# Altium project Smartwatch.PrjPcb (part 2 of 2)

## Sheet IO_Expander.SchDoc: IO Expander
size A4; Engineer: Jason Skells; SheetNumber: 4; SheetTotal: 4
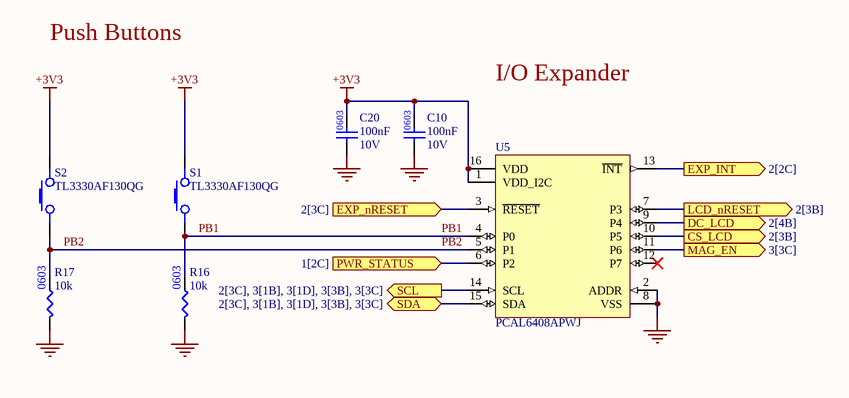
[diagram p3: IO_Expander.SchDoc]

### Parts
C10  Capacitance: 100nF  Voltage Rating: 10V  [CAP_0603]  (hidden comment: CC0603KRX7R6BB104)
C20  Capacitance: 100nF  Voltage Rating: 10V  [CAP_0603]  (hidden comment: CC0603KRX7R6BB104)
R16  Resistance: 10k  [RES_0603]  (hidden comment: RNCP0603FTD10K0)
R17  Resistance: 10k  [RES_0603]  (hidden comment: RNCP0603FTD10K0)
S1  TL3330AF130QG  [TL3330AF130QG]
S2  TL3330AF130QG  [TL3330AF130QG]
U5  PCAL6408APWJ  [PCAL6408APWJ]

### Ports
CS_LCD (out, see 2[3B]), DC_LCD (out, see 2[4B]), EXP_INT (out, see 2[2C]), EXP_nRESET (in, see 2[3C]), LCD_nRESET (out, see 2[3B]), MAG_EN (out, see 3[3C]), PWR_STATUS (in, see 1[2C]), SCL (out, see 2[3C], 3[1B], 3[1D], 3[3B], 3[3C]), SDA (bidir, see 2[3C], 3[1B], 3[1D], 3[3B], 3[3C])

### Nets
+3V3: C10.2 C20.2 S1.1 S2.1 U5.1(VDD_I2C) U5.16(VDD)
GND: C10.1 C20.1 R16.1 R17.1 U5.2(ADDR) U5.8(VSS)
CS_LCD: U5.10(P5) ; port CS_LCD
DC_LCD: U5.9(P4) ; port DC_LCD
EXP_INT: U5.13(~{INT}) ; port EXP_INT
EXP_nRESET: U5.3(~{RESET}) ; port EXP_nRESET
LCD_nRESET: U5.7(P3) ; port LCD_nRESET
MAG_EN: U5.11(P6) ; port MAG_EN
PB1: R16.2 S1.2 U5.4(P0)
PB2: R17.2 S2.2 U5.5(P1)
PWR_STATUS: U5.6(P2) ; port PWR_STATUS
SCL: U5.14(SCL) ; port SCL
SDA: U5.15(SDA) ; port SDA

Not connected (* = marked no-connect by the designer): U5 12(P7)*

### Notes on the sheet
- Push Buttons
- I/O Expander

### Library data of the parts
C10 C20 = CC0603KRX7R6BB104: CAP CER 0.1UF 10V X7R 0603; Manufacturer: Yageo; Tolerance: 10%; Supplier 1: Digi-Key; Manufacturer Part Number: CC0603KRX7R6BB104; RoHS: Yes; Category: Ceramic Capacitors; Stock 1: 135167; Pricing 1: 1=0.11000, 10=0.07700, 50=0.04340, 100=0.03600, 500=0.02522, 1000=0.02089 (USD); Mount: Surface Mount; Case/Package: 0603; Case Code (Imperial): 0603; Case Code (Metric): 1608; Weight: 7.1E-05oz; Min Operating Temperature: -55°C; Max Operating Temperature: 125°C; Dielectric: X7R; Voltage Rating (DC): 10V; Packaging: Tape and Reel; Termination: SMD/SMT; Resistor Type: Ceramic; Series: CC; Construction: Flat; Length: 1.6mm; Width: 0.8mm; Height: 0.8mm; Thickness: 0.035inch; Depth: 0.8mm; Radiation Hardening: No; Lead Free: Lead Free; Halogen Free: Halogen Free; RoHS Compliant: Yes; ComponentLink1URL: https://datasheet.ciiva.com/11586/upy-gphc-x7r-6-3v-to-50v-8-11586327.pdf?src-supplier=Avnet; ComponentLink1Description: https://datasheet.ciiva.com/11586/upy-gphc-x7r-6-3v-to-50v-8-11586327.pdf?src-supplier=Avnet; Supplier Part Number 1: 311-4055-1-ND
R16 R17 = RNCP0603FTD10K0: Res Thin Film 0603 10K Ohm 1% 1/8W ±100ppm/°C Molded SMD SMD Paper T/R; Manufacturer: Stackpole Electronics; Max Power Dissipation: 125mW; Supplier 1: Digi-Key; Manufacturer Part Number: RNCP0603FTD10K0; RoHS: Yes; Category: Chip SMD Resistors; Stock 1: 2737524; Pricing 1: 1=0.10000, 10=0.06100, 100=0.02480, 1000=0.01113, 2500=0.00966 (USD); Mount: Surface Mount; Case/Package: 0603; Case Code (Metric): 1608; Case Code (Imperial): 0603; Contact Plating: Tin,Matte; Min Operating Temperature: -55°C; Max Operating Temperature: 155°C; Packaging: Tape and Reel; Tolerance: 1%; Resistor Type: Thin Film; Number of Terminations: 2; Temperature Coefficient: 100ppm/°C; Features: Moisture Resistant,Anti-Sulfur; Series: RNCP; Length: 0.059inch; Width: 0.031inch; Height: 0.02inch; Radiation Hardening: No; Lead Free: Lead Free; RoHS Compliant: Yes; ComponentLink1URL: https://www.seielect.com/Catalog/SEI-rncp.pdf?src-supplier=Avnet; ComponentLink1Description: https://www.seielect.com/Catalog/SEI-rncp.pdf?src-supplier=Avnet; ComponentLink2URL: https://www.seielect.com/Catalog/SEI-rncp.pdf?src-supplier=Digi-Key; ComponentLink2Description: https://www.seielect.com/Catalog/SEI-rncp.pdf?src-supplier=Digi-Key; ComponentLink3URL: https://www.seielect.com/catalog/SEI-Packaging.pdf?src-supplier=Digi-Key; ComponentLink3Description: https://www.seielect.com/catalog/SEI-Packaging.pdf?src-supplier=Digi-Key; Supplier Part Number 1: RNCP0603FTD10K0CT-ND
S1 S2 = TL3330AF130QG: Switch Tactile N.O. SPST Rectangular Button Gull Wing 0.05A 12VDC 50000Cycles 1.27N SMD T/R; Manufacturer: E-Switch; Actuator Material: Nylon,Polyamide; Operating Force: 130gf; Illumination Type: Non-Illuminated,Illuminated; Switch Travel: 0.25mm; Switch Function: Off-Mom; Voltage Rating (DC): 12V; Contact Resistance: 100mR; Current Rating: 50mA; Actuator Length: 1mm; Supplier 1: Digi-Key; RoHS: Yes; Category: Tactile Switches; Stock 1: 42241; Pricing 1: 1=0.51000, 10=0.48800, 25=0.47000, 100=0.40680, 250=0.37060, 500=0.34350, 1000=0.30734 (USD); Mount: Surface Mount; Case/Package: SMD/SMT; Contact Plating: Silver; Mechanical Life: 50000Cycles; Contact Material: Silver; Color: Black; Min Operating Temperature: -30°C; Max Operating Temperature: 70°C; Package Quantity: 1; Packaging: Tape and Reel; Throw Configuration: SPST; Termination: Gull Wing; Orientation: Right Angle; Series: TL3330; Max Voltage Rating (DC): 12V; Electrical Life: 50000Cycles; Size: 5.3mm; Lead Free: Lead Free; REACH SVHC: No SVHC; RoHS Compliant: Yes; ComponentLink1URL: https://datasheet.ciiva.com/2900/p010950-2900785.pdf?src-supplier=Digi-Key; ComponentLink1Description: https://datasheet.ciiva.com/2900/p010950-2900785.pdf?src-supplier=Digi-Key; ComponentLink2URL: https://datasheet.ciiva.com/23713/tl3330-23713381.pdf?src-supplier=Newark; ComponentLink2Description: https://datasheet.ciiva.com/23713/tl3330-23713381.pdf?src-supplier=Newark; ComponentLink3URL: https://datasheet.ciiva.com/2900/p010950-2900786.pdf?src-supplier=Digi-Key; ComponentLink3Description: https://datasheet.ciiva.com/2900/p010950-2900786.pdf?src-supplier=Digi-Key; ComponentLink4URL: https://datasheet.ciiva.com/2900/p010950-2900787.pdf?src-supplier=Digi-Key; ComponentLink4Description: https://datasheet.ciiva.com/2900/p010950-2900787.pdf?src-supplier=Digi-Key; Supplier Part Number 1: EG4388CT-ND; Manufacturer Part Number: TL3330AF130QG
U5 = PCAL6408APWJ: NXP - PCAL6408APWJ - I/O-Erweiterung, 8bit, 400 kHz, I2C, 1.65 V, 5.5 V, TSSOP; Manufacturer: NXP Semiconductors; Output Current: 25mA; Min Supply Voltage: 1.65V; Max Supply Voltage: 5.5V; Number of I/Os: 8; Frequency: 400kHz; Supplier 1: Digi-Key; RoHS: Yes; Category: Interface ICs; Stock 1: 9585; Pricing 1: 1=1.57000, 10=1.40600, 25=1.33400, 100=1.29330 (USD); Mount: Surface Mount; Case/Package: TSSOP; Number of Pins: 16; Min Operating Temperature: -40°C; Max Operating Temperature: 85°C; Package Quantity: 1; Interface: I2C; Packaging: Tape and Reel; Max Frequency: 400kHz; Series: -; REACH SVHC: No SVHC; Lead Free: Lead Free; RoHS Compliant: Yes; ComponentLink1URL: https://datasheet.ciiva.com/6633/pcal6408a-6633104.pdf?src-supplier=Digi-Key; ComponentLink1Description: https://datasheet.ciiva.com/6633/pcal6408a-6633104.pdf?src-supplier=Digi-Key; Supplier Part Number 1: 568-9921-1-ND; Manufacturer Part Number: PCAL6408APWJ

## Nets that join several sheets
+3V3: Board_Power (C17.2 U10.1 U10.2 U10.4), ESP32 (10 pins), Sensors (16 pins), IO_Expander (6 pins)
+VBAT: Board_Power (7 pins), ESP32 (R4.2)
+VBUS: Board_Power (6 pins), ESP32 (J1.A4/B9 J1.B4/A9)
GND: Board_Power (16 pins), ESP32 (39 pins), Sensors (21 pins), IO_Expander (6 pins)
CS_LCD: ESP32 (R25.1 U1.8), IO_Expander (U5.10)
DC_LCD: ESP32 (U1.7), IO_Expander (U5.9)
EXP_INT: ESP32 (U2.30), IO_Expander (U5.13)
EXP_nRESET: ESP32 (U2.31), IO_Expander (U5.3)
HRM_EN: ESP32 (U2.13), Sensors (R12.1 U4.7)
HRM_INT: ESP32 (U2.12), Sensors (R26.1 U4.8)
LCD_nRESET: ESP32 (U1.11), IO_Expander (U5.7)
LSM_INT: ESP32 (U2.16), Sensors (R9.1 U3.4)
MAG_EN: Sensors (Q2.2 R18.2), IO_Expander (U5.11)
PWR_STATUS: Board_Power (R20.1 U8.1), IO_Expander (U5.6)
RTC_INT: ESP32 (U2.21), Sensors (U6.4)
SCL: ESP32 (R7.1 U2.5), Sensors (U3.13 U4.9 U6.7 U7.A2), IO_Expander (U5.14)
SDA: ESP32 (R8.1 U2.22), Sensors (U3.14 U4.10 U6.6 U7.B2), IO_Expander (U5.15)